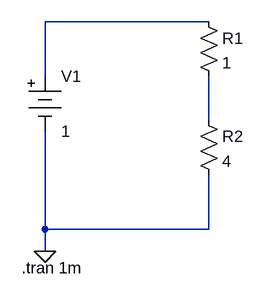
[diagram p0: schematic s-311_1.asc]
s-311_1.asc, the LTspice schematic file:
Version 4
SHEET 1 880 680
WIRE 304 48 64 48
WIRE 64 128 64 48
WIRE 304 192 304 128
WIRE 64 352 64 208
WIRE 304 352 304 272
WIRE 304 352 64 352
WIRE 64 384 64 352
FLAG 64 384 0
SYMBOL res 288 32 R0
SYMATTR InstName R1
SYMATTR Value 1
SYMBOL res 288 176 R0
SYMATTR InstName R2
SYMATTR Value 4
SYMBOL Misc\\battery 64 112 R0
WINDOW 123 0 0 Left 0
WINDOW 39 0 0 Left 0
SYMATTR InstName V1
SYMATTR Value 1
TEXT 30 408 Left 2 !.tran 1m

The netlist it stands for:
* s-311_1.asc
R1 N001 N002 1
R2 N002 0 4
V1 N001 0 1
.tran 1m
.backanno
.end